# Altium schematic sheet 单片机实验开发板.SchDoc
size A2; SheetNumber: 1; SheetTotal: 1
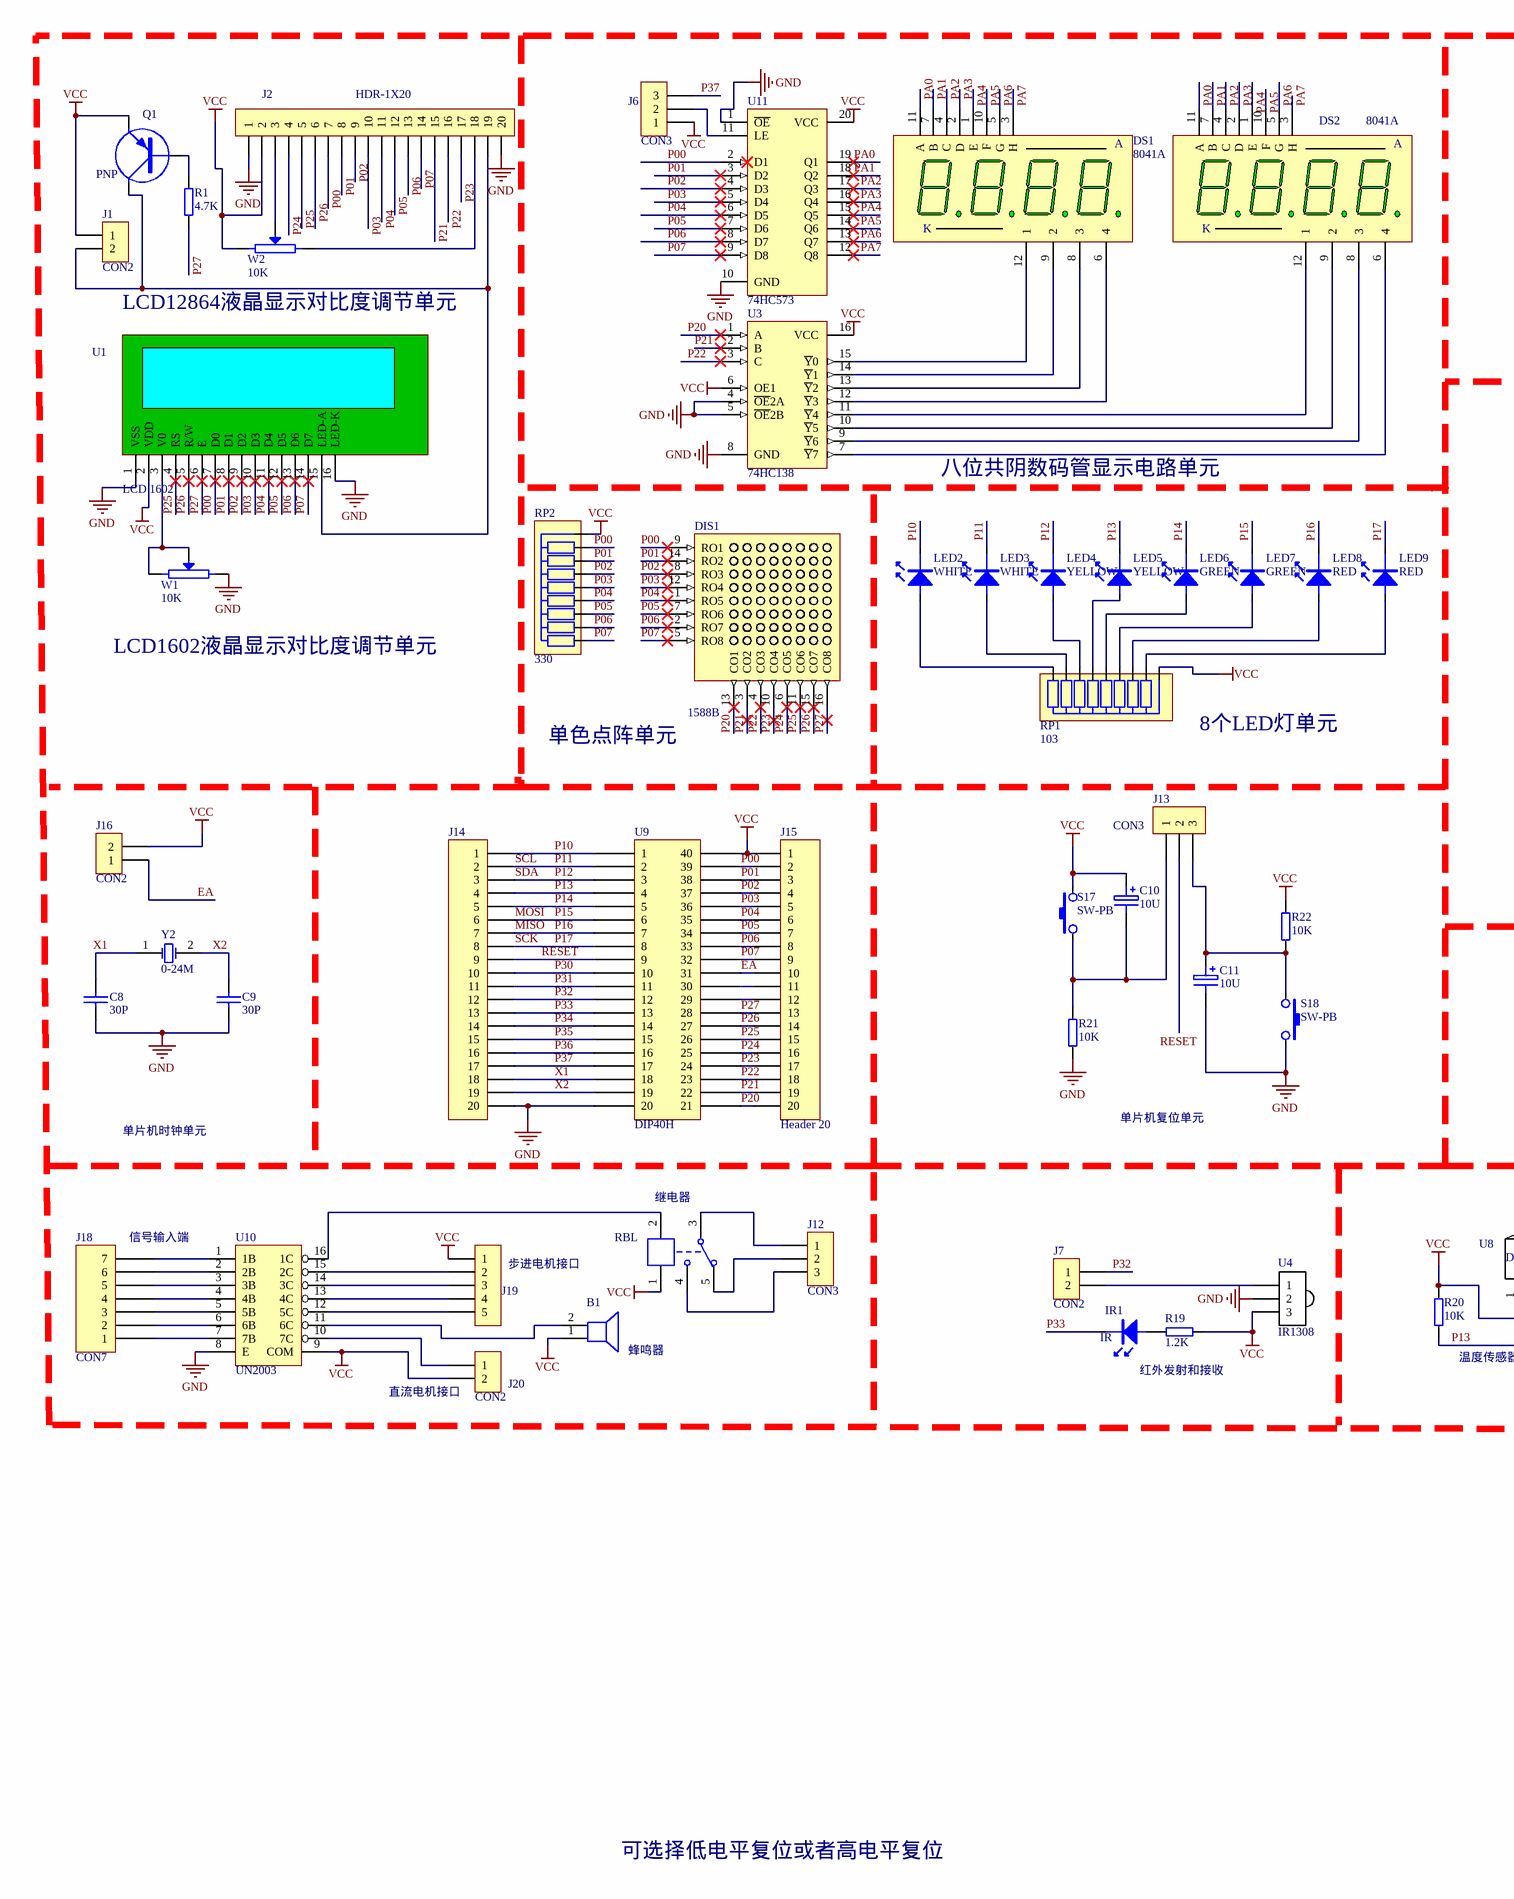
[diagram p0: 单片机实验开发板.SchDoc, left]
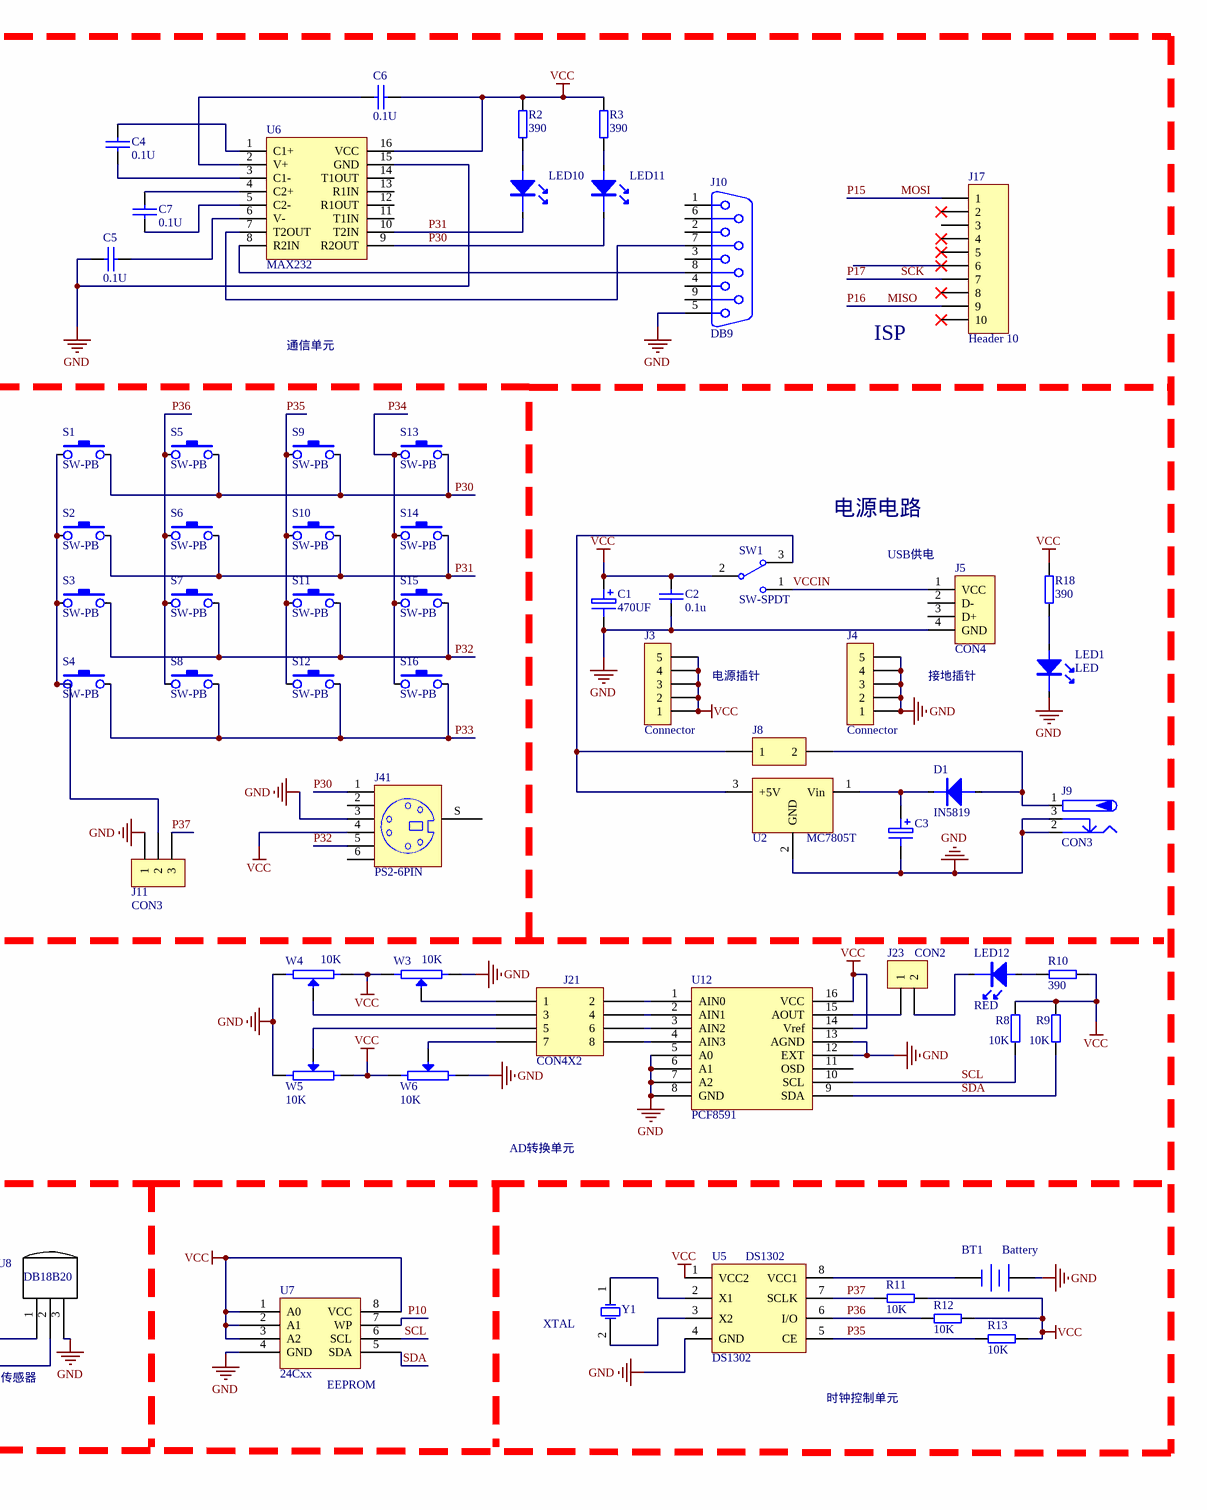
[diagram p1: 单片机实验开发板.SchDoc, right]

## Parts
B1  SPEAKER  [speaker]  (value not drawn)
BT1  Battery  [CR1220_A]
C1  470UF  [RB.1/.2]
C2  0.1u  [0805C]
C3  (no value)  [RB.1/.2]
C4  0.1U  [RAD0.1]
C5  0.1U  [RAD0.1]
C6  0.1U  [RAD0.1]
C7  0.1U  [RAD0.1]
C8  30P  [RAD0.1]
C9  30P  [RAD0.1]
C10  10U  [RB.1/.2]
C11  10U  [RB.1/.2]
D1  IN5819  [DIODE0.4]
DIS1  1588B  [LED 8*8(1)]
DS1  8041A  [SMG 0.4-4P]
DS2  8041A  [SMG 0.4-4P]
IR1  IR  [LED]
J1  CON2  [SIP2]
J2  HDR-1X20  [HDR1X20]
J3  Connector  [HDR1X5]
J4  Connector  [HDR1X5]
J5  CON4  [USB-A/S_A]
J6  CON3  [HDR1X3]
J7  CON2  [SIP2]
J8  CON1X2  [SIP2]  (value not drawn)
J9  CON3  [DC-005]
J10  DB9  [DB9-VP-2R74]
J11  CON3  [HDR1X3]
J12  CON3  [5.08-S301]
J13  CON3  [HDR1X3]
J14  (no value)  [HDR1X20]
J15  Header 20  [HDR1X20]
J16  CON2  [SIP2]
J17  Header 10  [DC-2.54-L-Z-10P]
J18  CON7  [HDR1X7]
J19  Connector  [HDR1X5]  (value not drawn)
J20  CON2  [SIP2]
J21  CON4X2  [HDR2X4]
J23  CON2  [SIP2]
J41  PS2-6PIN  [PS2-6PIN]
LED1  LED  [LED]
LED2  WHITE  [LED]
LED3  WHITE  [LED]
LED4  YELLOW  [LED]
LED5  YELLOW  [LED]
LED6  GREEN  [LED]
LED7  GREEN  [LED]
LED8  RED  [LED]
LED9  RED  [LED]
LED10  WHITE  [LED]  (value not drawn)
LED11  WHITE  [LED]  (value not drawn)
LED12  RED  [LED]
Q1  PNP  [TO-92C]
R1  4.7K  [6-0805_N]
R2  390  [6-0805_N]
R3  390  [6-0805_N]
R8  10K  [6-0805_N]
R9  10K  [6-0805_N]
R10  390  [6-0805_N]
R11  10K  [6-0805_N]
R12  10K  [6-0805_N]
R13  10K  [6-0805_N]
R18  390  [6-0805_N]
R19  1.2K  [6-0805_N]
R20  10K  [6-0805_N]
R21  10K  [6-0805_N]
R22  10K  [6-0805_N]
RBL  Relay-S-DC5V  [Relay-C_Y]  (value not drawn)
RP1  103  [R-SIP9]
RP2  330  [R-SIP9]
S1  SW-PB  [SW-MINI]
S2  SW-PB  [SW-MINI]
S3  SW-PB  [SW-MINI]
S4  SW-PB  [SW-MINI]
S5  SW-PB  [SW-MINI]
S6  SW-PB  [SW-MINI]
S7  SW-PB  [SW-MINI]
S8  SW-PB  [SW-MINI]
S9  SW-PB  [SW-MINI]
S10  SW-PB  [SW-MINI]
S11  SW-PB  [SW-MINI]
S12  SW-PB  [SW-MINI]
S13  SW-PB  [SW-MINI]
S14  SW-PB  [SW-MINI]
S15  SW-PB  [SW-MINI]
S16  SW-PB  [SW-MINI]
S17  SW-PB  [SW-MINI]
S18  SW-PB  [SW-MINI]
SW1  SW-SPDT  [SS-12D10]
U1  LCD 1602  [HDR1X16]
U2  MC7805T  [TO220C]
U3  74HC138  [SOP16_N]
U4  IR1308  [TO-92A]
U5  DS1302  [SOP8]
U6  MAX232  [SOP16]
U7  24Cxx  [SO8_L]
U8  3PIN  [TO-92A]  (value not drawn)
U9  DIP40H  [ZIF40]
U10  UN2003  [SOP16]
U11  74HC573  [SOP20-208]
U12  PCF8591  [SO16NB]
W1  10K  [VR1]
W2  10K  [VR1]
W3  10K  [VR1]
W4  10K  [VR1]
W5  10K  [VR1]
W6  10K  [VR1]
Y1  XTAL  [XTAL2]
Y2  0-24M  [XTAL2]

## Nets
GND: BT1.2(-) C1.2 C2.2 C3.2 C5.2 C8.2 C9.2 C11.2 J2.1 J2.20 J4.1 J4.2 J4.3 J4.4 J4.5 J5.4(GND) J9.2 J9.3 J10.5 J11.1 J14.20 J41.3 LED1.K R21.1 S18.2 U1.1(VSS) U1.16(LED-K) U2.2(GND) U3.4(~{OE}2A) U3.5(~{OE}2B) U3.8(GND) U4.2 U5.4(GND) U6.15(GND) U7.4(GND) U8.3 U9.20 U10.8(E) U11.1(~{OE}) U11.10(GND) U12.5(A0) U12.6(A1) U12.7(A2) U12.8(GND) U12.12(EXT) U12.13(AGND) W1.2 W3.1 W4.2 W5.2 W6.2
VCC: B1.1 C1.1 C2.1 C6.2 C10.1 J1.1 J2.2 J3.1 J3.2 J3.3 J3.4 J3.5 J6.1 J15.1 J16.2 J19.1 J20.2 J41.4 Q1.E R2.2 R3.2 R8.2 R9.2 R10.2 R11.2 R12.2 R13.2 R18.2 R19.2 R20.2 R22.2 RBL.1 RP1.1 RP2.1 S17.2 SW1.2 U1.2(VDD) U3.6(OE1) U3.16(VCC) U4.3 U5.1(VCC2) U6.16(VCC) U7.1(A0) U7.2(A1) U7.3(A2) U7.8(VCC) U8.1 U9.40 U10.9(COM) U11.20(VCC) U12.14(Vref) U12.16(VCC) W2.1 W3.2 W4.1 W5.1 W6.1
EA: J15.10 J16.1 U9.31
MISO: J14.7 J17.9 LED8.K U9.7  [also labelled P16]
MOSI: J14.6 J17.1 LED7.K U9.6  [also labelled P15]
P00: DIS1.9(RO1) J2.7 J15.2 RP2.2 U1.7(D0) U9.39 U11.2(D1)
P01: DIS1.14(RO2) J2.8 J15.3 RP2.3 U1.8(D1) U9.38 U11.3(D2)
P02: DIS1.8(RO3) J2.9 J15.4 RP2.4 U1.9(D2) U9.37 U11.4(D3)
P03: DIS1.12(RO4) J2.10 J15.5 RP2.5 U1.10(D3) U9.36 U11.5(D4)
P04: DIS1.1(RO5) J2.11 J15.6 RP2.6 U1.11(D4) U9.35 U11.6(D5)
P05: DIS1.7(RO6) J2.12 J15.7 RP2.7 U1.12(D5) U9.34 U11.7(D6)
P06: DIS1.2(RO7) J2.13 J15.8 RP2.8 U1.13(D6) U9.33 U11.8(D7)
P07: DIS1.5(RO8) J2.14 J15.9 RP2.9 U1.14(D7) U9.32 U11.9(D8)
P10: J14.1 LED2.K U7.7(WP) U9.1
P11: J14.2 LED3.K R8.1 U7.6(SCL) U9.2 U12.10(SCL)  [also labelled SCL]
P12: J14.3 LED4.K R9.1 U7.5(SDA) U9.3 U12.9(SDA)  [also labelled SDA]
P13: J14.4 LED5.K R20.1 U8.2 U9.4
P14: J14.5 LED6.K U9.5
P17: J14.8 J17.7 LED9.K U9.8  [also labelled SCK]
P20: DIS1.13(CO1) J15.20 U3.1(A) U9.21
P21: DIS1.3(CO2) J2.15 J15.19 U3.2(B) U9.22
P22: DIS1.4(CO3) J2.16 J15.18 U3.3(C) U9.23
P23: DIS1.10(CO4) J2.17 J15.17 U9.24
P24: DIS1.6(CO5) J2.4 J15.16 U9.25
P25: DIS1.11(CO6) J2.5 J15.15 U1.4(RS) U9.26
P26: DIS1.15(CO7) J2.6 J15.14 U1.5(R/W) U9.27
P27: DIS1.16(CO8) J15.13 R1.1 U1.6(E) U9.28
P30: J14.10 J41.1 LED11.K S1.2 S5.2 S9.2 S13.2 U6.9(R2OUT) U9.10
P31: J14.11 LED10.K S2.2 S6.2 S10.2 S14.2 U6.10(T2IN) U9.11
P32: J7.1 J14.12 J41.5 S3.2 S7.2 S11.2 S15.2 U9.12
P33: IR1.K J14.13 S4.2 S8.2 S12.2 S16.2 U9.13
P34: J14.14 S13.1 S14.1 S15.1 S16.1 U9.14
P35: J14.15 R13.1 S9.1 S10.1 S11.1 S12.1 U5.5(CE) U9.15
P36: J14.16 R12.1 S5.1 S6.1 S7.1 S8.1 U5.6(I/O) U9.16
P37: J6.3 J11.3 J14.17 R11.1 U5.7(SCLK) U9.17
PA0: DS1.11(A) DS2.11(A) U11.19(Q1)
PA1: DS1.7(B) DS2.7(B) U11.18(Q2)
PA2: DS1.4(C) DS2.4(C) U11.17(Q3)
PA3: DS1.2(D) DS2.2(D) U11.16(Q4)
PA4: DS1.1(E) DS2.1(E) U11.15(Q5)
PA5: DS1.10(F) DS2.10(F) U11.14(Q6)
PA6: DS1.5(G) DS2.5(G) U11.13(Q7)
PA7: DS1.3(H) DS2.3(H) U11.12(Q8)
RESET: J13.2 J14.9 U9.9
VCCIN: J5.1(VCC) SW1.1
X1: C8.1 J14.18 U9.18 Y2.1(OSC1)
X2: C9.1 J14.19 U9.19 Y2.2(OSC2)
NetB1_2: B1.2 U10.11(6C)
NetBT1_1: BT1.1(+) U5.8(VCC1)
NetC3_1: C3.1 D1.K U2.1(Vin)
NetC4_1: C4.1 U6.1(C1+)
NetC4_2: C4.2 U6.3(C1-)
NetC5_1: C5.1 U6.6(V-)
NetC6_1: C6.1 U6.2(V+)
NetC7_1: C7.1 U6.4(C2+)
NetC7_2: C7.2 U6.5(C2-)
NetC10_2: C10.2 J13.1 R21.2 S17.1
NetC11_1: C11.1 J13.3 R22.1 S18.1
NetD1_A: D1.A J8.2 J9.1
NetDS1_6: DS1.6(4) U3.12(~{Y}3)
NetDS1_8: DS1.8(3) U3.13(~{Y}2)
NetDS1_9: DS1.9(2) U3.14(~{Y}1)
NetDS1_12: DS1.12(1) U3.15(~{Y}0)
NetDS2_6: DS2.6(4) U3.7(~{Y}7)
NetDS2_8: DS2.8(3) U3.9(~{Y}6)
NetDS2_9: DS2.9(2) U3.10(~{Y}5)
NetDS2_12: DS2.12(1) U3.11(~{Y}4)
NetIR1_A: IR1.A R19.1
NetJ1_2: J1.2 J2.19 Q1.C U1.15(LED-A)
NetJ2_3: J2.3 W2.3
NetJ2_18: J2.18 W2.2
NetJ6_2: J6.2 U11.11(LE)
NetJ7_2: J7.2 U4.1
NetJ8_1: J8.1 SW1.3 U2.3(+5V)
NetJ10_7: J10.7 U6.7(T2OUT)
NetJ10_8: J10.8 U6.8(R2IN)
NetJ11_2: J11.2 S1.1 S2.1 S3.1 S4.1
NetJ12_1: J12.1 RBL.3
NetJ12_2: J12.2 RBL.5
NetJ12_3: J12.3 RBL.4
NetJ15_11: J15.11 U9.30
NetJ15_12: J15.12 U9.29
NetJ18_1: J18.1 U10.7(7B)
NetJ18_2: J18.2 U10.6(6B)
NetJ18_3: J18.3 U10.5(5B)
NetJ18_4: J18.4 U10.4(4B)
NetJ18_5: J18.5 U10.3(3B)
NetJ18_6: J18.6 U10.2(2B)
NetJ18_7: J18.7 U10.1(1B)
NetJ19_2: J19.2 U10.15(2C)
NetJ19_3: J19.3 U10.14(3C)
NetJ19_4: J19.4 U10.13(4C)
NetJ19_5: J19.5 U10.12(5C)
NetJ20_1: J20.1 U10.10(7C)
NetJ21_1: J21.1 W3.3
NetJ21_2: J21.2 U12.1(AIN0)
NetJ21_3: J21.3 W4.3
NetJ21_4: J21.4 U12.2(AIN1)
NetJ21_5: J21.5 W5.3
NetJ21_6: J21.6 U12.3(AIN2)
NetJ21_7: J21.7 W6.3
NetJ21_8: J21.8 U12.4(AIN3)
NetJ23_1: J23.1 U12.15(AOUT)
NetJ23_2: J23.2 LED12.K
NetLED1_A: LED1.A R18.1
NetLED2_A: LED2.A RP1.9
NetLED3_A: LED3.A RP1.8
NetLED4_A: LED4.A RP1.7
NetLED5_A: LED5.A RP1.6
NetLED6_A: LED6.A RP1.5
NetLED7_A: LED7.A RP1.4
NetLED8_A: LED8.A RP1.3
NetLED9_A: LED9.A RP1.2
NetLED10_A: LED10.A R2.1
NetLED11_A: LED11.A R3.1
NetLED12_A: LED12.A R10.1
NetQ1_B: Q1.B R1.2
NetRBL_2: RBL.2 U10.16(1C)
NetU1_3: U1.3(V0) W1.1 W1.3
NetU5_2: U5.2(X1) Y1.1(OSC1)
NetU5_3: U5.3(X2) Y1.2(OSC2)

Not connected (* = marked no-connect by the designer): J5 2(D-) 3(D+); J10 1 2 3 4 6 9; J17 2* 3 4* 5* 6* 8* 10*; J41 2 6 S; U6 11(T1IN) 12(R1OUT) 13(R1IN) 14(T1OUT); U12 11(OSD)

## Notes on the sheet
- LCD12864液晶显示对比度调节单元
- 通信单元
- ISP
- 八位共阴数码管显示电路单元
- 电源电路
- (near J5) USB供电
- LCD1602液晶显示对比度调节单元
- (near J3) 电源插针
- 接地插针
- 单色点阵单元
- (near RP1) 8个LED灯单元
- 单片机复位单元
- 单片机时钟单元
- AD转换单元
- (near J18) 信号输入端
- (near RBL) 继电器
- (near U5) DS1302
- (near J19) 步进电机接口
- (near J20) 直流电机接口
- (near B1) 蜂鸣器
- 红外发射和接收
- (near R20) 温度传感器
- (near U7) EEPROM
- 时钟控制单元
- 可选择低电平复位或者高电平复位
- (in symbol 8041A) K

## Library data of the parts
BT1 = Battery: Multicell Battery; Published: 24-Mar-1999; LatestRevisionDate: 17-Jul-2002; LatestRevisionNote: Re-released for DXP Platform.; PackageReference: BAT-2; Publisher: Altium Limited; PackageDescription: Battery; 2 Leads
C1 C3 C10 C11 = ELECTRO1: Electrolytic Capacitor
C2 C4-C9 = CAP: Capacitor
D1 = DIODE
DIS1 = 1588B: 共阳单色LED8*8点阵屏; 版权归属: 源创客; BOM名称: 共阳单色LED8*8点阵屏; 学习资源: www.ooocke.com
DS1 DS2 = 8041A: 0.8寸4位共阴数码管; 版权归属: 源创客; BOM名称: 0.8寸4位共阴; 学习资源: www.ooocke.com
IR1 LED2-LED12 = LED
J1 J7 J16 J20 J23 = CON2: Connector
J2 = Header 20: 20P接插件; 版权归属: 源创客; BOM名称: 20P接插件; 学习资源: www.ooocke.com
J3 J4 J19 = CON5
J5 = USB-A/S: USB-A型母接口; 版权归属: 源创客; BOM名称: USB-A型母接口; 学习资源: www.ooocke.com
J6 J11-J13 = CON3: Connector
J9 = P-DC: 低压电源接口; BOM名称: DC电源接口; 版权归属: 源创客; 学习资源: www.ooocke.com
J10 = DB9: 9针串口; 版权归属: 源创客; BOM名称: 9针串口; 学习资源: www.ooocke.com
J14 J15 = Header 20: Header, 20-Pin; LatestRevisionDate: 17-Jul-2002; LatestRevisionNote: Re-released for DXP Platform.; Publisher: Altium Limited
J17 = Header 10: Header, 10-Pin; LatestRevisionDate: 17-Jul-2002; LatestRevisionNote: Re-released for DXP Platform.; Publisher: Altium Limited
J41 = PS2-6PIN: 6 Pin Through Hole PS2 Socket (Kycon P/N); Published: 17-Dec-2003; Publisher: Altium Limited; ComponentLink1Description: Manufacturer Link; ComponentLink1URL: http://www.oupiin.com/prodindx.html#Headers
R1-R3 R8-R13 R18-R22 = RES2
RBL = Relay-S-DC5V: 5V一组转换; BOM名称: 5V继电器; 版权归属: 源创客; 学习资源: www.ooocke.com
RP1 RP2 = R SIP9: 单列直插排阻; 版权归属: 源创客; BOM名称: 单列直插排阻; 学习资源: www.ooocke.com
S1-S18 = SW-PB1
SW1 = SW-SPDT: SPDT Subminiature Toggle Switch, Right Angle Mounting, Vertical Actuation; Published: 24-Mar-1999; LatestRevisionDate: 17-Dec-2003; LatestRevisionNote: Schematic revised, PCB Footprint replaced.; DatasheetVersion: 05-Dec-2000; PackageReference: TL36WW15050; Publisher: Altium Limited; PackageDescription: Switch; 4 Leads; ComponentLink1Description: Manufacturer Link; ComponentLink1URL: http://www.apem.com
U1 = LCD 1602: 版权归属: 源创客; BOM名称: LCD 1602; 学习资源: www.ooocke.com
U3 = 74HC138: 138译码器; 版权归属: 源创客; 学习资源: www.ooocke.com; BOM名称: 138译码器
U5 = DS1302: 实时时钟芯片; 版权归属: 源创客; BOM名称: 实时时钟芯片; 学习资源: www.ooocke.com
U6 = MAX232: 版权归属: 源创客; BOM名称: MAX232; 学习资源: www.ooocke.com
U7 = 24Cxx: 外置EEPROM; 版权归属: 源创客; BOM名称: 外置EEPROM; 学习资源: www.ooocke.com
U8 = DB18B20
U10 = ULN2003-2: 达林顿驱动芯片; 版权归属: 源创客; BOM名称: 达林顿驱动芯片; 学习资源: www.ooocke.com
U11 = 74HC573: D类三态输出锁存器; 版权归属: 源创客; BOM名称: 三态输出锁存器; 学习资源: www.ooocke.com
W1-W6 = POT2: Potentiometer
Y1 Y2 = XTAL: Crystal Oscillator; Published: 8-Jun-2000; LatestRevisionDate: 17-Jul-2002; LatestRevisionNote: Re-released for DXP Platform.; PackageReference: R38; Publisher: Altium Limited; PackageDescription: Crystal, Thru-Hole; 2 Leads; Body 3.1 x 8.2 mm (Dia.xH)